# Altium project PT-MIS-PCB-001_v1.PrjPCB (part 1 of 3)
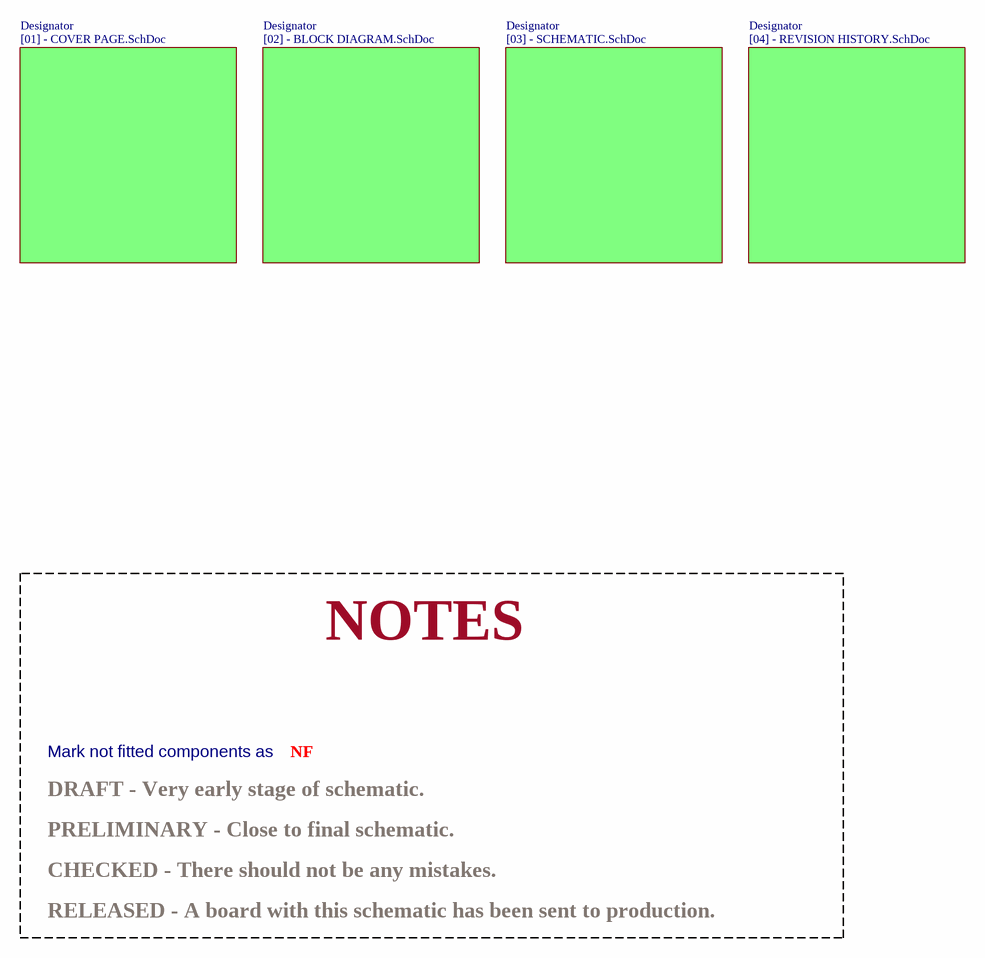
[diagram p0: PT-MIS-PCB-001_v1 Project.SchDoc]
Checked: JABN; DocumentRevision: v1.1
5 sheets, 114 parts. Net scope: global (net labels, ports and power ports of the same name join across sheets).
Board file: PT-MIS-PCB-001_v1.PcbDoc
Sheets:
  PT-MIS-PCB-001_v1 Project.SchDoc
    Designator = [01] - COVER PAGE.SchDoc
    Designator = [02] - BLOCK DIAGRAM.SchDoc
    Designator = [04] - REVISION HISTORY.SchDoc
    Designator = [03] - SCHEMATIC.SchDoc

## Sheet PT-MIS-PCB-001_v1 Project.SchDoc
size A4; DocumentNumber: 5; SheetNumber: 5; SheetTotal: 5

### Sub-sheets
Designator = [01] - COVER PAGE.SchDoc: no entries
Designator = [02] - BLOCK DIAGRAM.SchDoc: no entries
Designator = [04] - REVISION HISTORY.SchDoc: no entries
Designator = [03] - SCHEMATIC.SchDoc: no entries

### Notes on the sheet
- NOTES
- DRAFT - Very early stage of schematic.
- Mark not fitted components as
- NF
- PRELIMINARY - Close to final schematic.
- CHECKED - There should not be any mistakes.
- RELEASED - A board with this schematic has been sent to production.
- Project:
- Page Contents:
- Size:
- Revision:
- A4
- Document Number:
- Design:
- Date:
- Sheet
- of

## Sheet [01] - COVER PAGE.SchDoc
size A4; DocumentNumber: 1; SheetNumber: 1; SheetTotal: 5
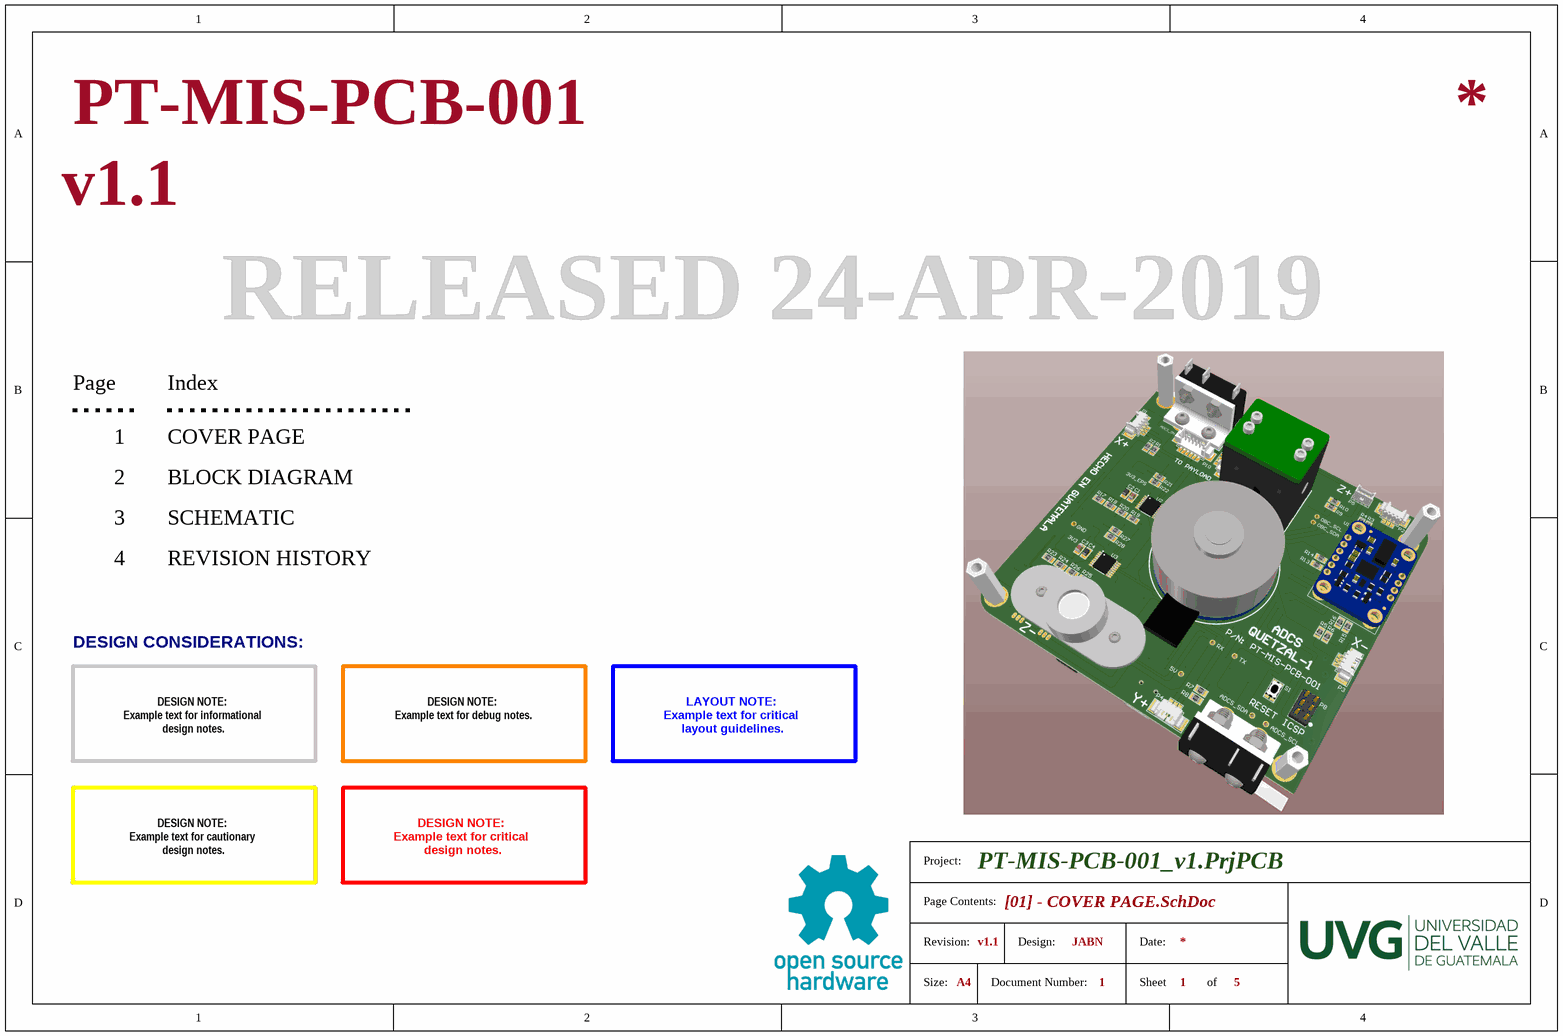
[diagram p1: [01] - COVER PAGE.SchDoc]

### Notes on the sheet
- PT-MIS-PCB-001
- RELEASED 24-APR-2019
- Page
- 1
- Index
- COVER PAGE
- 2
- BLOCK DIAGRAM
- 3
- 4
- SCHEMATIC
- REVISION HISTORY
- DESIGN CONSIDERATIONS:
- DESIGN NOTE:
  Example text for debug notes.
- DESIGN NOTE:
  Example text for informational
  design notes.
- LAYOUT NOTE:
  Example text for critical
  layout guidelines.
- DESIGN NOTE:
  Example text for cautionary
  design notes.
- DESIGN NOTE:
  Example text for critical
  design notes.
- Project:
- Page Contents:
- Size:
- Revision:
- A4
- Document Number:
- Design:
- Date:
- Sheet
- of

## Sheet [02] - BLOCK DIAGRAM.SchDoc
size A4; DocumentNumber: 2; SheetNumber: 2; SheetTotal: 5
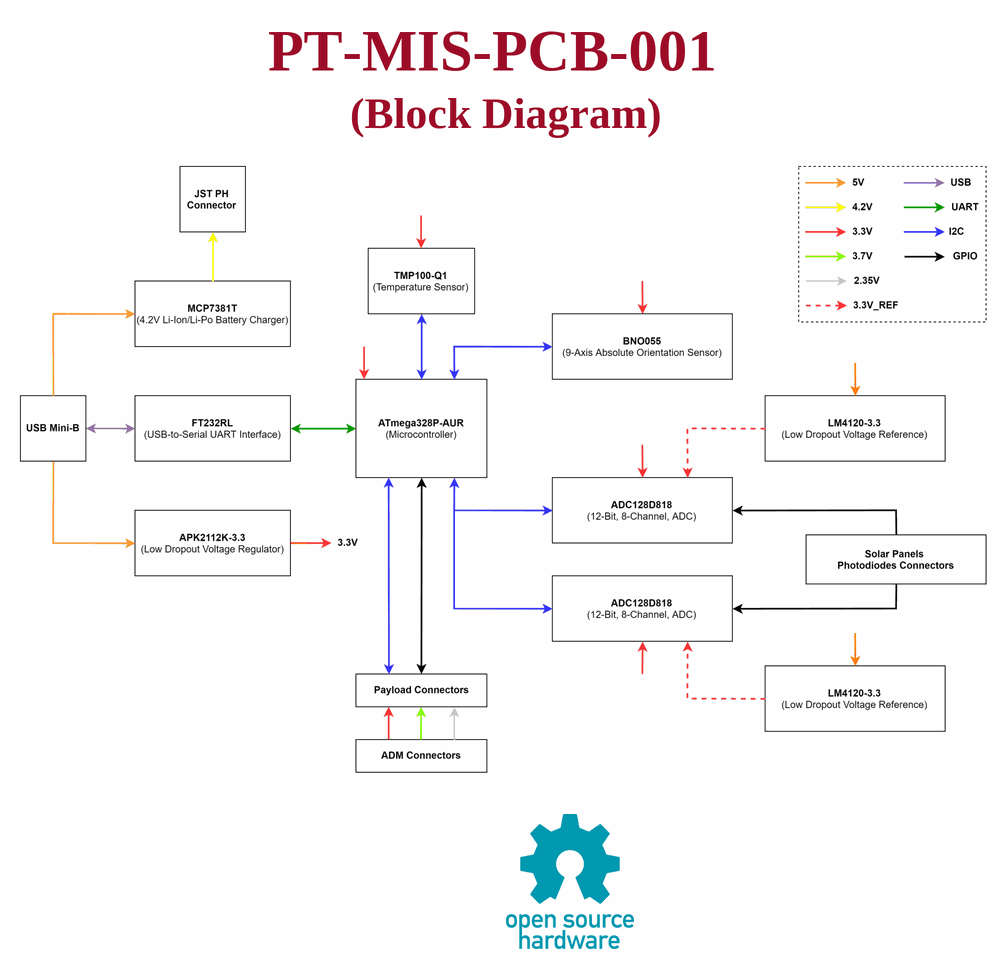
[diagram p2: [02] - BLOCK DIAGRAM.SchDoc]

### Notes on the sheet
- PT-MIS-PCB-001
- (Block Diagram)
- Project:
- Page Contents:
- Size:
- Revision:
- A4
- Document Number:
- Design:
- Date:
- Sheet
- of

## Sheet [04] - REVISION HISTORY.SchDoc
size A4; DocumentNumber: 4; SheetNumber: 4; SheetTotal: 5
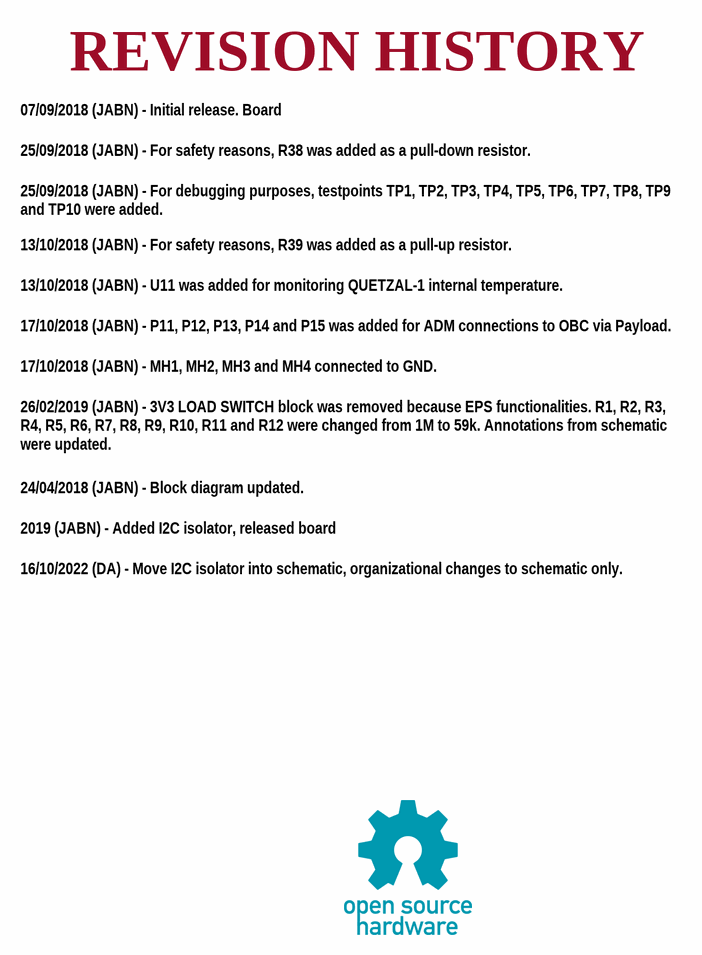
[diagram p3: [04] - REVISION HISTORY.SchDoc]

### Notes on the sheet
- 07/09/2018 (JABN) - Initial release. Board
- REVISION HISTORY
- 25/09/2018 (JABN) - For safety reasons, R38 was added as a pull-down resistor.
- 25/09/2018 (JABN) - For debugging purposes, testpoints TP1, TP2, TP3, TP4, TP5, TP6, TP7, TP8, TP9 and TP10 were added.
- 13/10/2018 (JABN) - For safety reasons, R39 was added as a pull-up resistor.
- 13/10/2018 (JABN) - U11 was added for monitoring QUETZAL-1 internal temperature.
- 17/10/2018 (JABN) - P11, P12, P13, P14 and P15 was added for ADM connections to OBC via Payload.
- 17/10/2018 (JABN) - MH1, MH2, MH3 and MH4 connected to GND.
- 26/02/2019 (JABN) - 3V3 LOAD SWITCH block was removed because EPS functionalities. R1, R2, R3, R4, R5, R6, R7, R8, R9, R10, R11 and R12 were changed from 1M to 59k. Annotations from schematic were updated.
- 24/04/2018 (JABN) - Block diagram updated.
- 16/10/2022 (DA) - Move I2C isolator into schematic, organizational changes to schematic only.
- 2019 (JABN) - Added I2C isolator, released board
- Project:
- Page Contents:
- Size:
- Revision:
- A4
- Document Number:
- Design:
- Date:
- Sheet
- of

## Sheet [03] - SCHEMATIC.SchDoc
size D; DocumentNumber: 3; SheetNumber: 3; SheetTotal: 5
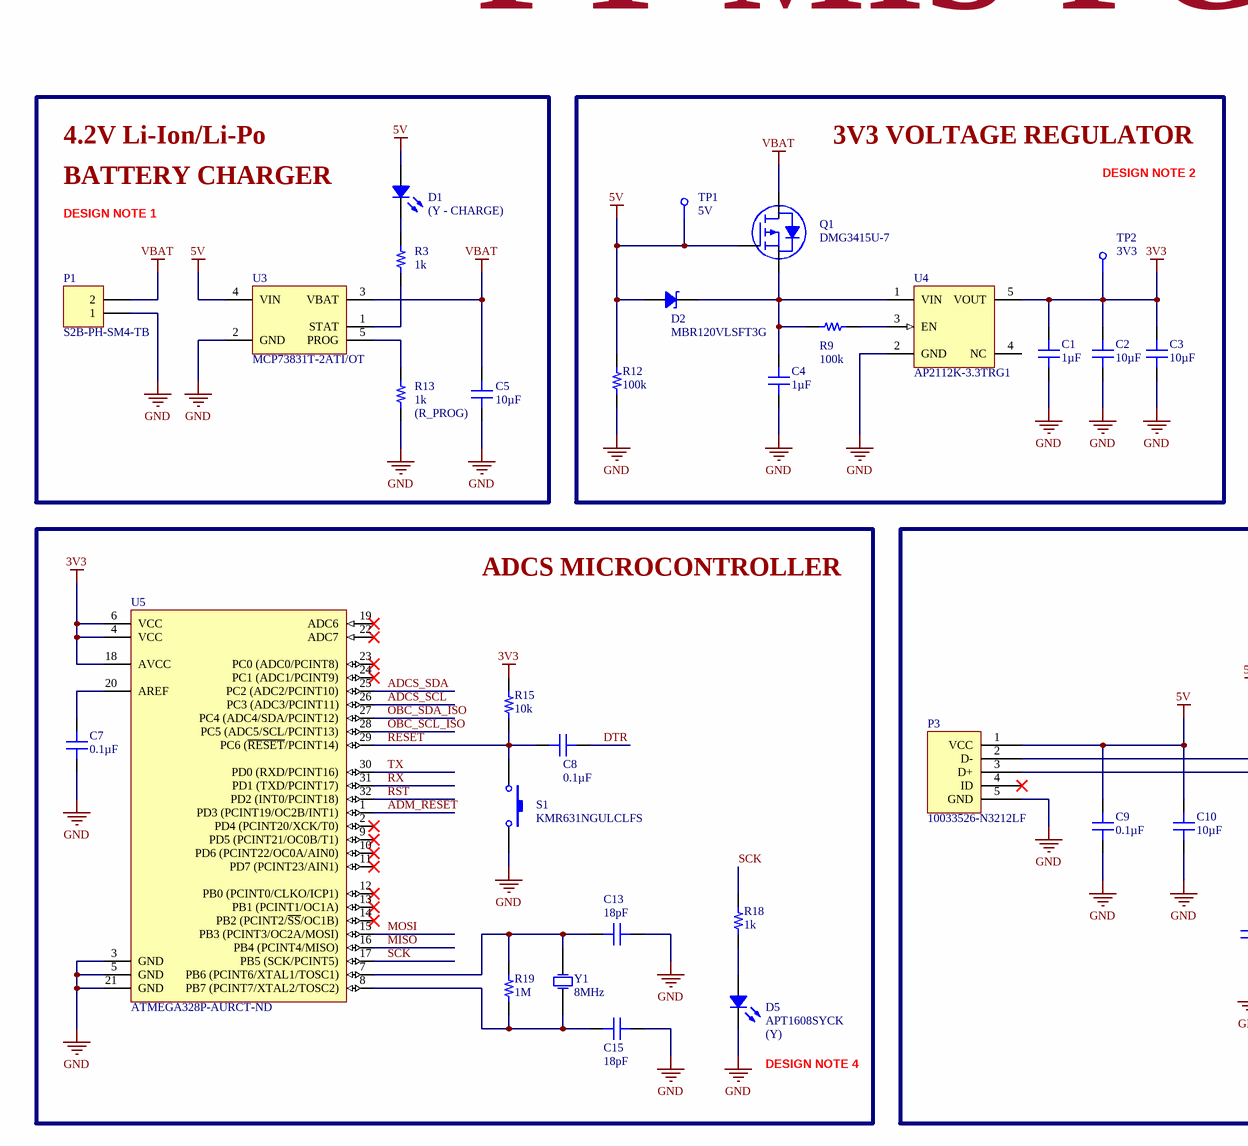
[diagram p4: [03] - SCHEMATIC.SchDoc, top left]
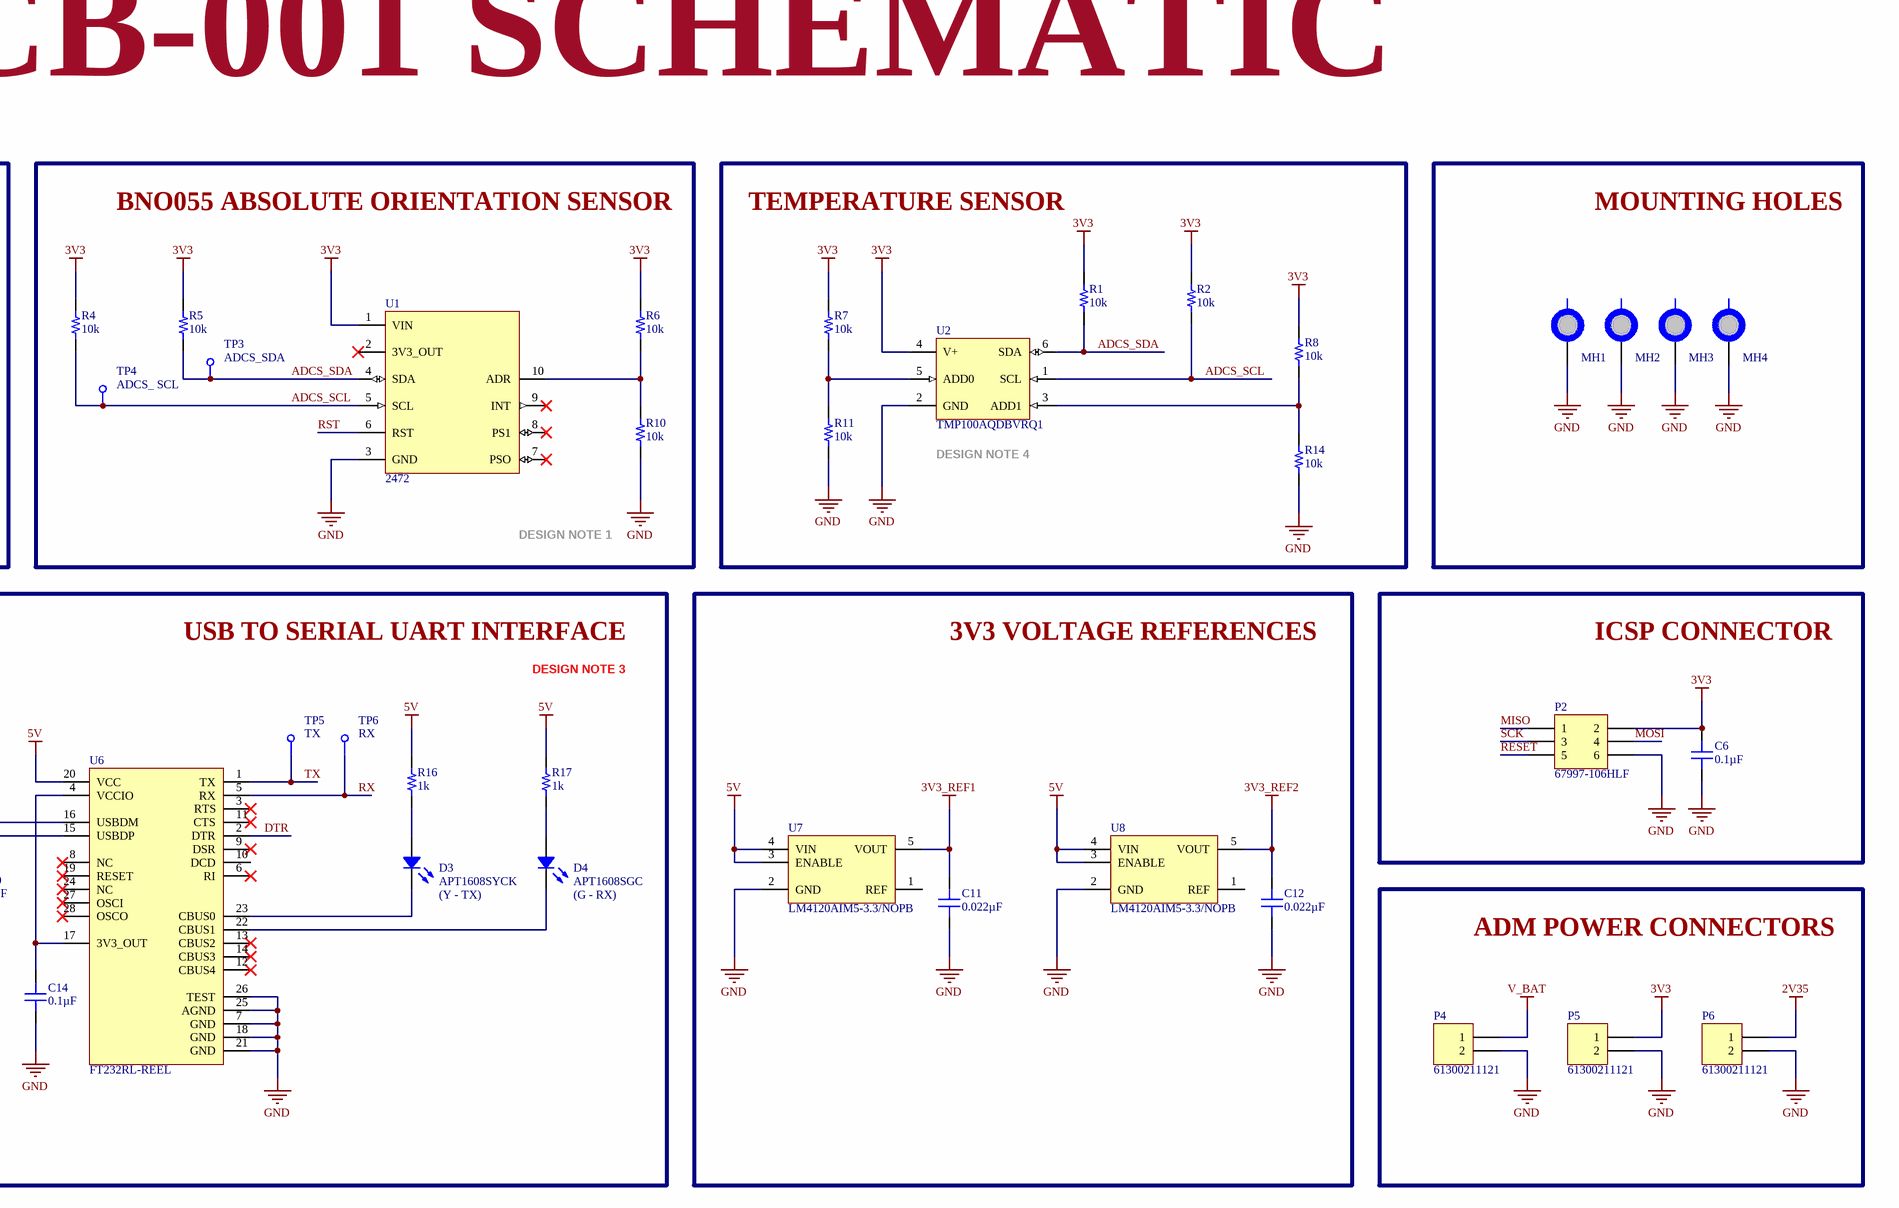
[diagram p5: [03] - SCHEMATIC.SchDoc, top right]
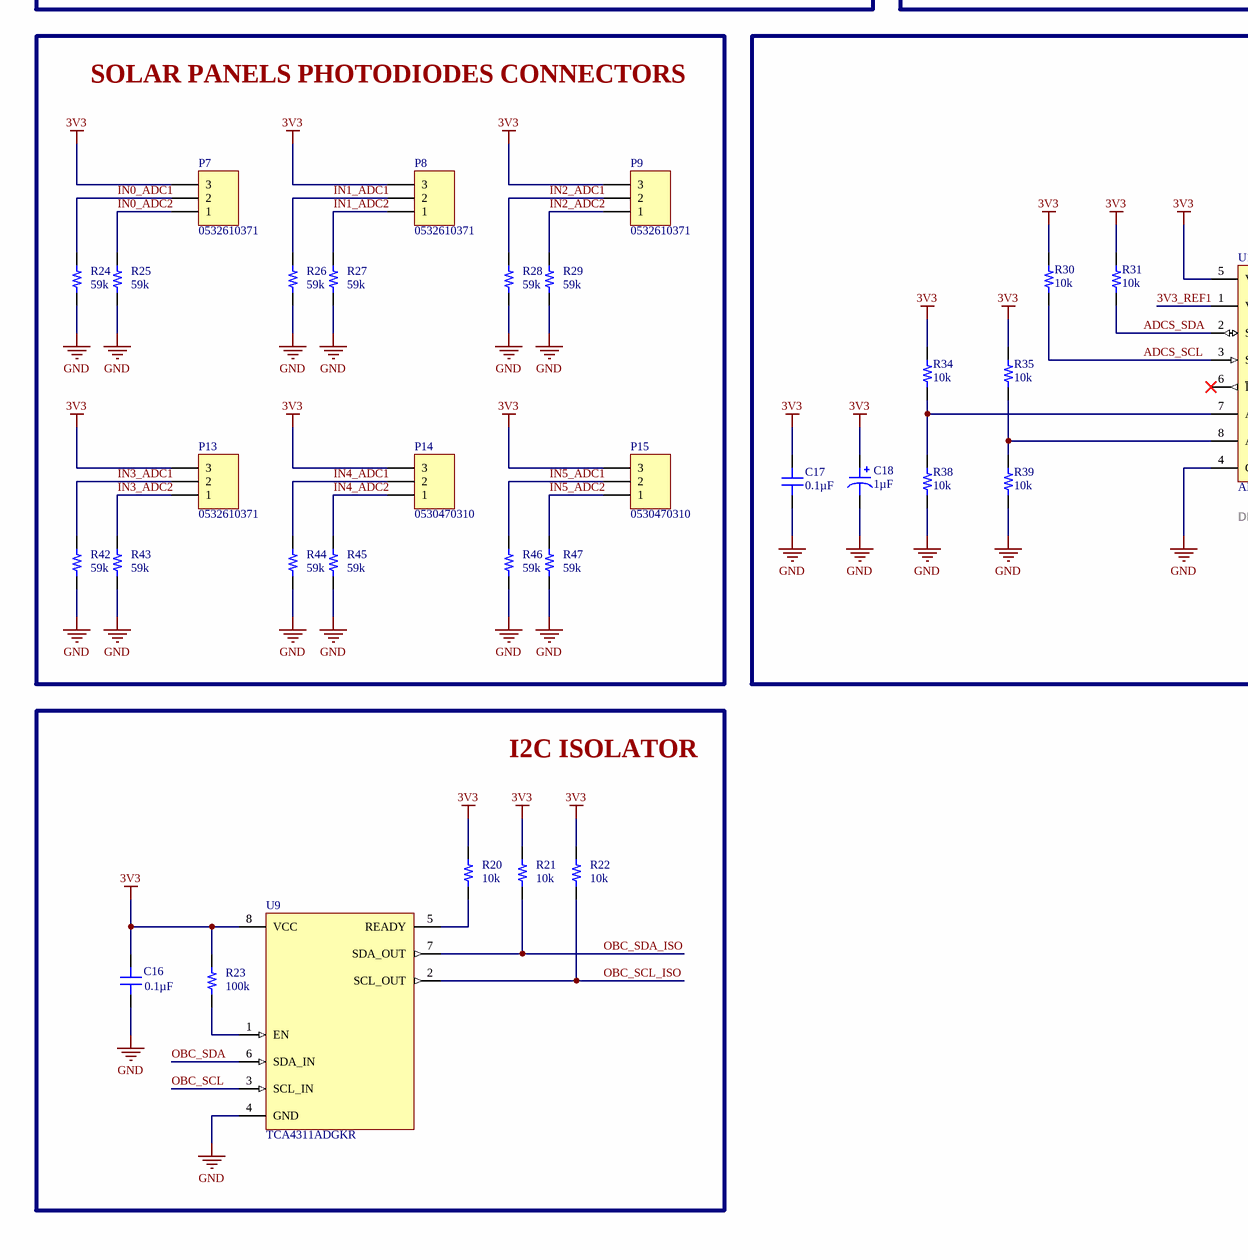
[diagram p6: [03] - SCHEMATIC.SchDoc, bottom left]
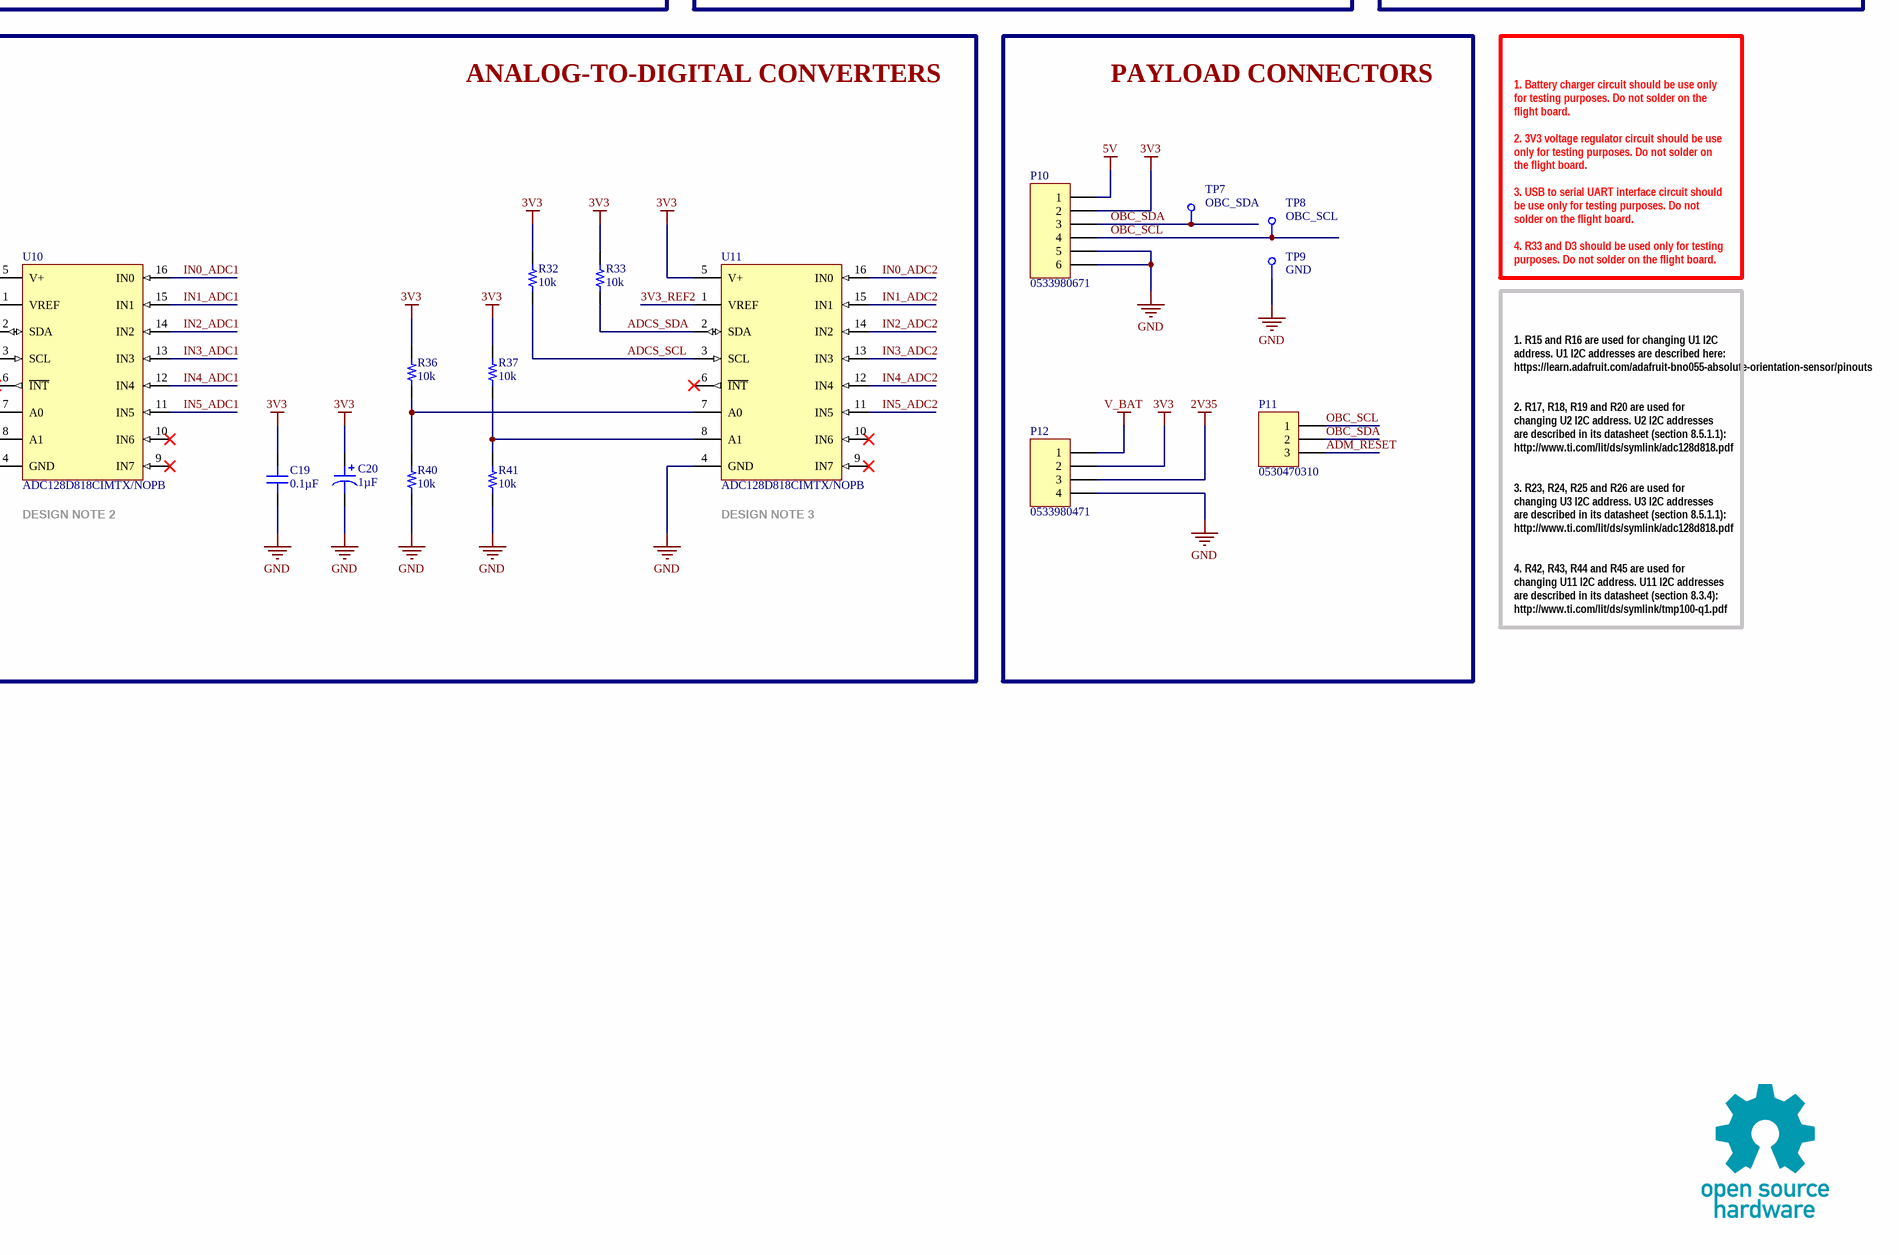
[diagram p7: [03] - SCHEMATIC.SchDoc, bottom right]

### Parts
C1  Capacitance: 1µF  [CAP 0805/2012]  (hidden comment: CC0805KKX7R7BB105)
C2  Capacitance: 10µF  [CAP 0805/2012]  (hidden comment: LMK212BJ106KG-T)
C3  Capacitance: 10µF  [CAP 0805/2012]  (hidden comment: LMK212BJ106KG-T)
C4  Capacitance: 1µF  [CAP 0805/2012]  (hidden comment: CC0805KKX7R7BB105)
C5  Capacitance: 10µF  [CAP 0805/2012]  (hidden comment: LMK212BJ106KG-T)
C6  Capacitance: 0.1µF  [CAP 0805/2012]  (hidden comment: C2012X7R1H104K085AA)
C7  Capacitance: 0.1µF  [CAP 0805/2012]  (hidden comment: C2012X7R1H104K085AA)
C8  Capacitance: 0.1µF  [CAP 0805/2012]  (hidden comment: C2012X7R1H104K085AA)
C9  Capacitance: 0.1µF  [CAP 0805/2012]  (hidden comment: C0805C104Z3VACTU)
C10  Capacitance: 10µF  [CAP 0805/2012]  (hidden comment: LMK212BJ106KG-T)
C11  Capacitance: 0.022µF  [CAP 0805/2012]  (hidden comment: GCM155R71H223KA55D)
C12  Capacitance: 0.022µF  [CAP 0805/2012]  (hidden comment: GCM155R71H223KA55D)
C13  Capacitance: 18pF  [CAP 0805/2012]  (hidden comment: C0805C180J5GAC-TU)
C14  Capacitance: 0.1µF  [CAP 0805/2012]  (hidden comment: C0805C104Z3VACTU)
C15  Capacitance: 18pF  [CAP 0805/2012]  (hidden comment: C0805C180J5GAC-TU)
C16  Capacitance: 0.1µF  [CAP 0805/2012]  (hidden comment: C0805C104Z3VACTU)
C17  Capacitance: 0.1µF  [CAP 0805/2012]  (hidden comment: C0805C104Z3VACTU)
C18  Capacitance: 1µF  [CAP 0805/2012 TANTALUM]  (hidden comment: F921C105MPA)
C19  Capacitance: 0.1µF  [CAP 0805/2012]  (hidden comment: C0805C104Z3VACTU)
C20  Capacitance: 1µF  [CAP 0805/2012 TANTALUM]  (hidden comment: F921C105MPA)
D1  APT1608SYCK  [LED 0603/1608 YELLOW]  (value not drawn)
D2  MBR120VLSFT3G  [SOD123F]
D3  APT1608SYCK  [LED 0603/1608 YELLOW]
D4  APT1608SGC  [LED 0603/1608 GREEN]
D5  APT1608SYCK  [LED 0603/1608 YELLOW]
MH1  MH_3.8MMNC_2.5MMD  [MH_3.8MMNC_2.5MMD_NON_COPPER_NPTH]  (value not drawn)  (no BOM)
MH2  MH_3.8MMNC_2.5MMD  [MH_3.8MMNC_2.5MMD_NON_COPPER_NPTH]  (value not drawn)  (no BOM)
MH3  MH_3.8MMNC_2.5MMD  [MH_3.8MMNC_2.5MMD_NON_COPPER_NPTH]  (value not drawn)  (no BOM)
MH4  MH_3.8MMNC_2.5MMD  [MH_3.8MMNC_2.5MMD_NON_COPPER_NPTH]  (value not drawn)  (no BOM)
P1  S2B-PH-SM4-TB  [S2B-PH-SM4-TB(LF)(SN)]
P2  67997-106HLF  [67997-106HLF]
P3  10033526-N3212LF  [FCI USB 10033526-N3212LF]
P4  61300211121  [61300211121]
P5  61300211121  [61300211121]
P6  61300211121  [61300211121]
P7  0532610371  [0532610371]
P8  0532610371  [0532610371]
P9  0532610371  [0532610371]
P10  0533980671  [0533980671]
P11  0530470310  [0530470310]
P12  0533980471  [0533980471]
P13  0532610371  [0532610371]
P14  0530470310  [0530470310]
P15  0530470310  [0530470310]
Q1  DMG3415U-7  [DIODES SOT-23-3]
R1  Resistance: 10k  [RES 0805/2012]  (hidden comment: RC0805FR-0710KL)
R2  Resistance: 10k  [RES 0805/2012]  (hidden comment: RC0805FR-0710KL)
R3  Resistance (Ohms): 1k  [RES 0805/2012]  (hidden comment: RNCP0805FTD1K00)
R4  Resistance: 10k  [RES 0805/2012]  (hidden comment: RR1220P-103-D)
R5  Resistance: 10k  [RES 0805/2012]  (hidden comment: RR1220P-103-D)
R6  Resistance: 10k  [RES 0805/2012]  (hidden comment: RR1220P-103-D)
R7  Resistance: 10k  [RES 0805/2012]  (hidden comment: RC0805FR-0710KL)
R8  Resistance: 10k  [RES 0805/2012]  (hidden comment: RC0805FR-0710KL)
R9  Resistance (Ohms): 100k  [RES 0805/2012]  (hidden comment: RPC0805JT100K)
R10  Resistance: 10k  [RES 0805/2012]  (hidden comment: RR1220P-103-D)
R11  Resistance: 10k  [RES 0805/2012]  (hidden comment: RC0805FR-0710KL)
R12  Resistance (Ohms): 100k  [RES 0805/2012]  (hidden comment: RPC0805JT100K)
R13  Resistance (Ohms): 1k  [RES 0805/2012]  (hidden comment: RNCP0805FTD1K00)
R14  Resistance: 10k  [RES 0805/2012]  (hidden comment: RC0805FR-0710KL)
R15  Resistance: 10k  [RES 0805/2012]  (hidden comment: RC0805FR-0710KL)
R16  Resistance (Ohms): 1k  [RES 0805/2012]  (hidden comment: RNCP0805FTD1K00)
R17  Resistance (Ohms): 1k  [RES 0805/2012]  (hidden comment: RNCP0805FTD1K00)
R18  Resistance (Ohms): 1k  [RES 0805/2012]  (hidden comment: RNCP0805FTD1K00)
R19  Resistance: 1M  [RES 0805/2012]  (hidden comment: RC0805FR-0710ML)
R20  Resistance: 10k  [RES 0805/2012]  (hidden comment: RR1220P-103-D)
R21  Resistance: 10k  [RES 0805/2012]  (hidden comment: RR1220P-103-D)
R22  Resistance: 10k  [RES 0805/2012]  (hidden comment: RR1220P-103-D)
R23  Resistance (Ohms): 100k  [RES 0805/2012]  (hidden comment: RPC0805JT100K)
R24  Resistance: 59k  [RES 0805/2012]  (hidden comment: ERA6AEB5902V)
R25  Resistance: 59k  [RES 0805/2012]  (hidden comment: ERA6AEB5902V)
R26  Resistance: 59k  [RES 0805/2012]  (hidden comment: ERA6AEB5902V)
R27  Resistance: 59k  [RES 0805/2012]  (hidden comment: ERA6AEB5902V)
R28  Resistance: 59k  [RES 0805/2012]  (hidden comment: ERA6AEB5902V)
R29  Resistance: 59k  [RES 0805/2012]  (hidden comment: ERA6AEB5902V)
R30  Resistance: 10k  [RES 0805/2012]  (hidden comment: RR1220P-103-D)
R31  Resistance: 10k  [RES 0805/2012]  (hidden comment: RR1220P-103-D)
R32  Resistance: 10k  [RES 0805/2012]  (hidden comment: RR1220P-103-D)
R33  Resistance: 10k  [RES 0805/2012]  (hidden comment: RR1220P-103-D)
R34  Resistance: 10k  [RES 0805/2012]  (hidden comment: RR1220P-103-D)
R35  Resistance: 10k  [RES 0805/2012]  (hidden comment: RR1220P-103-D)
R36  Resistance: 10k  [RES 0805/2012]  (hidden comment: RR1220P-103-D)
R37  Resistance: 10k  [RES 0805/2012]  (hidden comment: RR1220P-103-D)
R38  Resistance: 10k  [RES 0805/2012]  (hidden comment: RR1220P-103-D)
R39  Resistance: 10k  [RES 0805/2012]  (hidden comment: RR1220P-103-D)
R40  Resistance: 10k  [RES 0805/2012]  (hidden comment: RR1220P-103-D)
R41  Resistance: 10k  [RES 0805/2012]  (hidden comment: RR1220P-103-D)
R42  Resistance: 59k  [RES 0805/2012]  (hidden comment: ERA6AEB5902V)
R43  Resistance: 59k  [RES 0805/2012]  (hidden comment: ERA6AEB5902V)
R44  Resistance: 59k  [RES 0805/2012]  (hidden comment: ERA6AEB5902V)
R45  Resistance: 59k  [RES 0805/2012]  (hidden comment: ERA6AEB5902V)
R46  Resistance: 59k  [RES 0805/2012]  (hidden comment: ERA6AEB5902V)
R47  Resistance: 59k  [RES 0805/2012]  (hidden comment: ERA6AEB5902V)
S1  KMR631NGULCLFS  [KMR631NGLFS]
TP1  5V  [Testpoint]
TP2  3V3  [Testpoint]
TP3  ADCS_SDA  [Testpoint]
TP4  ADCS_ SCL  [Testpoint]
TP5  TX  [Testpoint]
TP6  RX  [Testpoint]
TP7  OBC_SDA  [Testpoint]
TP8  OBC_SCL  [Testpoint]
TP9  GND  [Testpoint]
U1  2472  [ADAFRUIT BNO055]
U2  TMP100AQDBVRQ1  [SOT95P245X145-6N]
U3  MCP73831T-2ATI/OT  [SOT95P245X110-5N]
U4  AP2112K-3.3TRG1  [DIODES SOT-23-5 W5]
U5  ATMEGA328P-AURCT-ND  [32A_L]
U6  FT232RL-REEL  [SOP65P790X200-28N]
U7  LM4120AIM5-3.3/NOPB  [SOT95P245X110-5N]
U8  LM4120AIM5-3.3/NOPB  [SOT95P245X110-5N]
U9  TCA4311ADGKR  [8-MSOP]
U10  ADC128D818CIMTX/NOPB  [TSOP65P640X120-16N]
U11  ADC128D818CIMTX/NOPB  [TSOP65P640X120-16N]
Y1  8MHz  [ABM7-16.000MHZ-D2Y-T]

### Blocks framed on the sheet
3V3 VOLTAGE REGULATOR: C1-C4 D2 Q1 R9 R12 TP1 TP2 U4
BNO055 ABSOLUTE ORIENTATION SENSOR: R4-R6 R10 TP3 TP4 U1
TEMPERATURE SENSOR: R1 R2 R7 R8 R11 R14 U2
MOUNTING HOLES: MH1-MH4
ADCS MICROCONTROLLER: C7 C8 C13 C15 D5 R15 R18 R19 S1 U5 Y1
USB TO SERIAL UART INTERFACE: C9 C10 C14 D3 D4 P3 R16 R17 TP5 TP6 U6
3V3 VOLTAGE REFERENCES: C11 C12 U7 U8
ICSP CONNECTOR: C6 P2
ADM POWER CONNECTORS: P4-P6
SOLAR PANELS PHOTODIODES CONNECTORS: P7-P9 P13-P15 R24-R29 R42-R47
ANALOG-TO-DIGITAL CONVERTERS: C17-C20 R30-R41 U10 U11
PAYLOAD CONNECTORS: P10-P12 TP7-TP9
I2C ISOLATOR: C16 R20-R23 U9

### Nets
2V35: P6.1 P12.3
3V3: C1.1 C2.2 C3.2 C6.2 C16.2 C17.2 C18.1 C19.2 C20.1 P2.2 P5.1 P7.3 P8.3 P9.3 P10.2 P12.2 P13.3 P14.3 P15.3 R1.2 R2.2 R4.1 R5.1 R6.1 R7.2 R8.2 R15.2 R20.2 R21.2 R22.2 R23.2 R30.1 R31.1 R32.1 R33.1 R34.2 R35.2 R36.2 R37.2 TP2.1 U1.1(VIN) U2.4(V+) U4.5(VOUT) U5.4(VCC) U5.6(VCC) U5.18(AVCC) U9.8(VCC) U10.5(V+) U11.5(V+)
3V3_REF1: C11.1 U7.5(VOUT) U10.1(VREF)
3V3_REF2: C12.1 U8.5(VOUT) U11.1(VREF)
5V: C9.2 C10.2 D1.1 D2.1 P3.1(VCC) P10.1 Q1.1(G) R12.2 R16.2 R17.2 TP1.1 U3.4(VIN) U6.20(VCC) U7.3(ENABLE) U7.4(VIN) U8.3(ENABLE) U8.4(VIN)
GND: C1.2 C2.1 C3.1 C4.2 C5.1 C6.1 C7.1 C9.1 C10.1 C11.2 C12.2 C13.1 C14.1 C15.1 C16.1 C17.1 C18.2 C19.1 C20.2 D5.2 MH1.1 MH2.1 MH3.1 MH4.1 P1.1 P2.6 P3.5(GND) P4.2 P5.2 P6.2 P10.5 P10.6 P12.4 R10.2 R11.1 R12.1 R13.2 R14.1 R24.1 R25.1 R26.1 R27.1 R28.1 R29.1 R38.1 R39.1 R40.1 R41.1 R42.1 R43.1 R44.1 R45.1 R46.1 R47.1 S1.2 TP9.1 U1.3(GND) U2.2(GND) U3.2(GND) U4.2(GND) U5.3(GND) U5.5(GND) U5.21(GND) U6.7(GND) U6.18(GND) U6.21(GND) U6.25(AGND) U6.26(TEST) U7.2(GND) U8.2(GND) U9.4(GND) U10.4(GND) U11.4(GND)
V_BAT: P4.1 P12.1
VBAT: C5.2 P1.2 Q1.2(D) U3.3(VBAT)
ADCS_SCL: R2.1 R4.2 R30.2 R32.2 TP4.1 U1.5(SCL) U2.1(SCL) U5.26(PC3_(ADC3/PCINT11)) U10.3(SCL) U11.3(SCL)
ADCS_SDA: R1.1 R5.2 R31.2 R33.2 TP3.1 U1.4(SDA) U2.6(SDA) U5.25(PC2_(ADC2/PCINT10)) U10.2(SDA) U11.2(SDA)
ADM_RESET: P11.3 U5.1(PD3_(PCINT19/OC2B/INT1))
DTR: C8.1 U6.2(DTR)
IN0_ADC1: P7.2 R24.2 U10.16(IN0)
IN0_ADC2: P7.1 R25.2 U11.16(IN0)
IN1_ADC1: P8.2 R26.2 U10.15(IN1)
IN1_ADC2: P8.1 R27.2 U11.15(IN1)
IN2_ADC1: P9.2 R28.2 U10.14(IN2)
IN2_ADC2: P9.1 R29.2 U11.14(IN2)
IN3_ADC1: P13.2 R42.2 U10.13(IN3)
IN3_ADC2: P13.1 R43.2 U11.13(IN3)
IN4_ADC1: P14.2 R44.2 U10.12(IN4)
IN4_ADC2: P14.1 R45.2 U11.12(IN4)
IN5_ADC1: P15.2 R46.2 U10.11(IN5)
IN5_ADC2: P15.1 R47.2 U11.11(IN5)
MISO: P2.1 U5.16(PB4_(PCINT4/MISO))
MOSI: P2.4 U5.15(PB3_(PCINT3/OC2A/MOSI))
OBC_SCL: P10.4 P11.1 TP8.1 U9.3(SCL_IN)
OBC_SCL_ISO: R22.1 U5.28(PC5_(ADC5/SCL/PCINT13)) U9.2(SCL_OUT)
OBC_SDA: P10.3 P11.2 TP7.1 U9.6(SDA_IN)
OBC_SDA_ISO: R21.1 U5.27(PC4_(ADC4/SDA/PCINT12)) U9.7(SDA_OUT)
RESET: C8.2 P2.5 R15.1 S1.1 U5.29(PC6_(~{RESET}/PCINT14))
RST: U1.6(RST) U5.32(PD2_(INT0/PCINT18))
RX: TP6.1 U5.31(PD1_(TXD/PCINT17)) U6.5(RX)
SCK: P2.3 R18.1 U5.17(PB5_(SCK/PCINT5))
TX: TP5.1 U5.30(PD0_(RXD/PCINT16)) U6.1(TX)
NetC4_1: C4.1 D2.2 Q1.3(S) R9.1 U4.1(VIN)
NetC7_2: C7.2 U5.20(AREF)
NetC13_2: C13.2 R19.2 U5.7(PB6_(PCINT6/XTAL1/TOSC1)) Y1.1(OSC1)
NetC14_2: C14.2 U6.4(VCCIO) U6.17(3V3_OUT)
NetC15_2: C15.2 R19.1 U5.8(PB7_(PCINT7/XTAL2/TOSC2)) Y1.2(OSC2)
NetD1_2: D1.2 R3.2
NetD3_1: D3.1 R16.1
NetD3_2: D3.2 U6.23(CBUS0)
NetD4_1: D4.1 R17.1
NetD4_2: D4.2 U6.22(CBUS1)
NetD5_1: D5.1 R18.2
NetP3_2: P3.2(D-) U6.16(USBDM)
NetP3_3: P3.3(D+) U6.15(USBDP)
NetR3_1: R3.1 U3.1(STAT)
NetR6_2: R6.2 R10.1 U1.10(ADR)
NetR7_1: R7.1 R11.2 U2.5(ADD0)
NetR8_1: R8.1 R14.2 U2.3(ADD1)
NetR9_2: R9.2 U4.3(EN)
NetR13_1: R13.1 U3.5(PROG)
NetR20_1: R20.1 U9.5(READY)
NetR23_1: R23.1 U9.1(EN)
NetR34_1: R34.1 R38.2 U10.7(A0)
NetR35_1: R35.1 R39.2 U10.8(A1)
NetR36_1: R36.1 R40.2 U11.7(A0)
NetR37_1: R37.1 R41.2 U11.8(A1)

Not connected (* = marked no-connect by the designer): P3 4(ID)*; U1 2(3V3_OUT)* 7(PSO)* 8(PS1)* 9(INT)*; U4 4(NC); U5 2(PD4_(PCINT20/XCK/T0))* 9(PD5_(PCINT21/OC0B/T1))* 10(PD6_(PCINT22/OC0A/AIN0))* 11(PD7_(PCINT23/AIN1))* 12(PB0_(PCINT0/CLKO/ICP1))* 13(PB1_(PCINT1/OC1A))* 14(PB2_(PCINT2/~{SS}/OC1B))* 19(ADC6)* 22(ADC7)* 23(PC0_(ADC0/PCINT8))* 24(PC1_(ADC1/PCINT9))*; U6 3(RTS)* 6(RI)* 8(NC)* 9(DSR)* 10(DCD) 11(CTS)* 12(CBUS4)* 13(CBUS2)* 14(CBUS3)* 19(RESET)* 24(NC)* 27(OSCI)* 28(OSCO)*; U7 1(REF); U8 1(REF); U10 6(~{INT})* 9(IN7)* 10(IN6)*; U11 6(~{INT})* 9(IN7)* 10(IN6)*

### Notes on the sheet
- PT-MIS-PCB-001 SCHEMATIC
- BATTERY CHARGER
- 4.2V Li-Ion/Li-Po
- DESIGN NOTE 2
- DESIGN NOTE 1
- (Y - CHARGE)
- (near U2) DESIGN NOTE 4
- (R_PROG)
- DESIGN NOTE 3
- (near D3) (Y - TX)
- (near D4) (G - RX)
- (near D5) (Y)
- DESIGN NOTE 4
- DESIGN NOTES
- 1. Battery charger circuit should be use only for testing purposes. Do not solder on the flight board.
- 2. 3V3 voltage regulator circuit should be use only for testing purposes. Do not solder on the flight board.
- 3. USB to serial UART interface circuit should be use only for testing purposes. Do not solder on the flight board.
- 4. R33 and D3 should be used only for testing purposes. Do not solder on the flight board.
- 1. R15 and R16 are used for changing U1 I2C address. U1 I2C addresses are described here: https://learn.adafruit.com/adafruit-bno055-absolute-orientation-sensor/pinouts
- 2. R17, R18, R19 and R20 are used for changing U2 I2C address. U2 I2C addresses are described in its datasheet (section 8.5.1.1): http://www.ti.com/lit/ds/symlink/adc128d818.pdf
- (near U10) DESIGN NOTE 2
- (near U11) DESIGN NOTE 3
- 3. R23, R24, R25 and R26 are used for changing U3 I2C address. U3 I2C addresses are described in its datasheet (section 8.5.1.1): http://www.ti.com/lit/ds/symlink/adc128d818.pdf
- 4. R42, R43, R44 and R45 are used for changing U11 I2C address. U11 I2C addresses are described in its datasheet (section 8.3.4): http://www.ti.com/lit/ds/symlink/tmp100-q1.pdf
- Project:
- Page Contents:
- Size:
- Revision:
- D
- Document Number:
- Design:
- Date:
- Sheet
- of